# Altium schematic sheet Main.SchDoc: Sweet Dreams - Main
size 292 x 193 mm; Author: Mikołaj Roszczyk; CompanyName: Politechnika Warszawska; Organization: WEITI; Revision: 2; SheetNumber: 1; SheetTotal: 5; Group_Name: Under Pressure; ProjName: Sweet Dreams
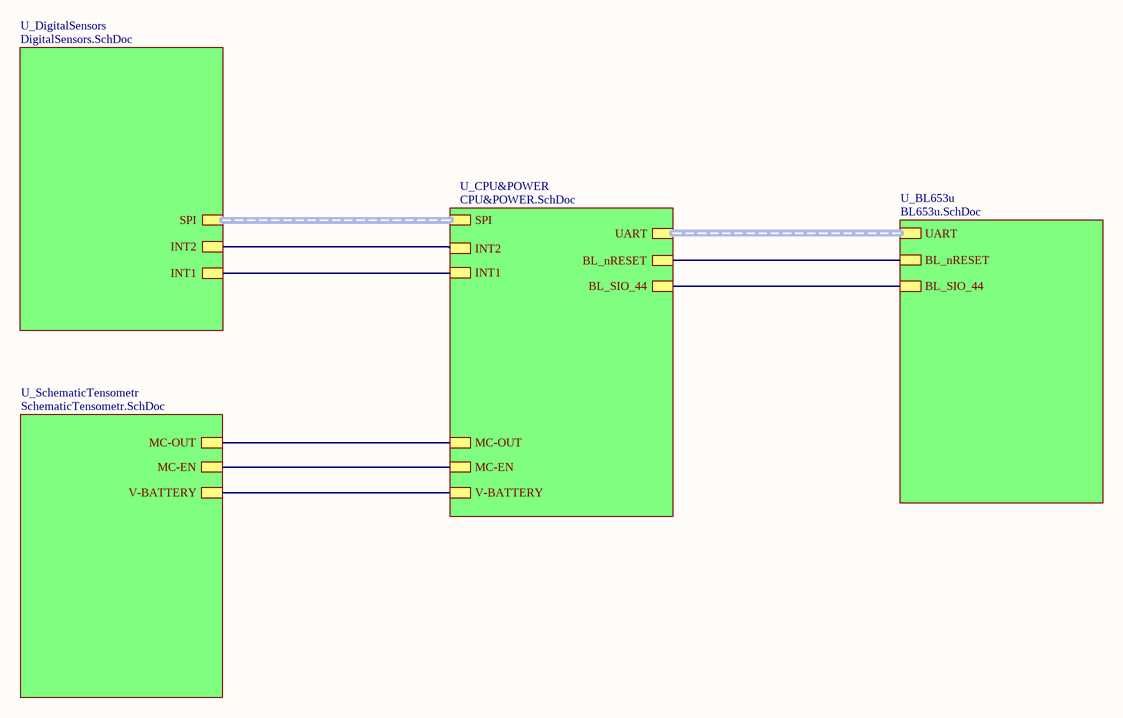
[diagram p0: Main.SchDoc]

## Sub-sheets
U_BL653u = BL653u.SchDoc: UART (harness BL_UART31), BL_nRESET, BL_SIO_44
U_CPU&POWER = CPU&POWER.SchDoc: SPI (harness SPI1), INT2, INT1, UART (harness BL_UART31), MC-OUT, MC-EN, BL_SIO_44, BL_nRESET, V-BATTERY
U_DigitalSensors = DigitalSensors.SchDoc: SPI (harness SPI1), INT1, INT2
U_SchematicTensometr = SchematicTensometr.SchDoc: MC-EN, MC-OUT, V-BATTERY

## Nets
(unnamed): sheet U_BL653u/BL_nRESET, sheet U_CPU&POWER/BL_nRESET
(unnamed): sheet U_BL653u/BL_SIO_44, sheet U_CPU&POWER/BL_SIO_44
(unnamed): sheet U_DigitalSensors/INT1, sheet U_CPU&POWER/INT1
(unnamed): sheet U_DigitalSensors/INT2, sheet U_CPU&POWER/INT2
(unnamed): sheet U_CPU&POWER/MC-OUT, sheet U_SchematicTensometr/MC-OUT
(unnamed): sheet U_CPU&POWER/MC-EN, sheet U_SchematicTensometr/MC-EN
(unnamed): sheet U_CPU&POWER/V-BATTERY, sheet U_SchematicTensometr/V-BATTERY

## Buses and harness runs
harness sheet U_BL653u/UART = sheet U_CPU&POWER/UART
harness sheet U_CPU&POWER/SPI = sheet U_DigitalSensors/SPI

## Notes on the sheet
- Data:
- Tytuł:
- Rev.:
- Rozm.:
- A4
- Strona:
- z
- PBL4
- Opracował: